# EAGLE design OreSat0_plusZendcard (EAGLE 9.6.2)

## Sheet 1 of 3: CONNECTORS
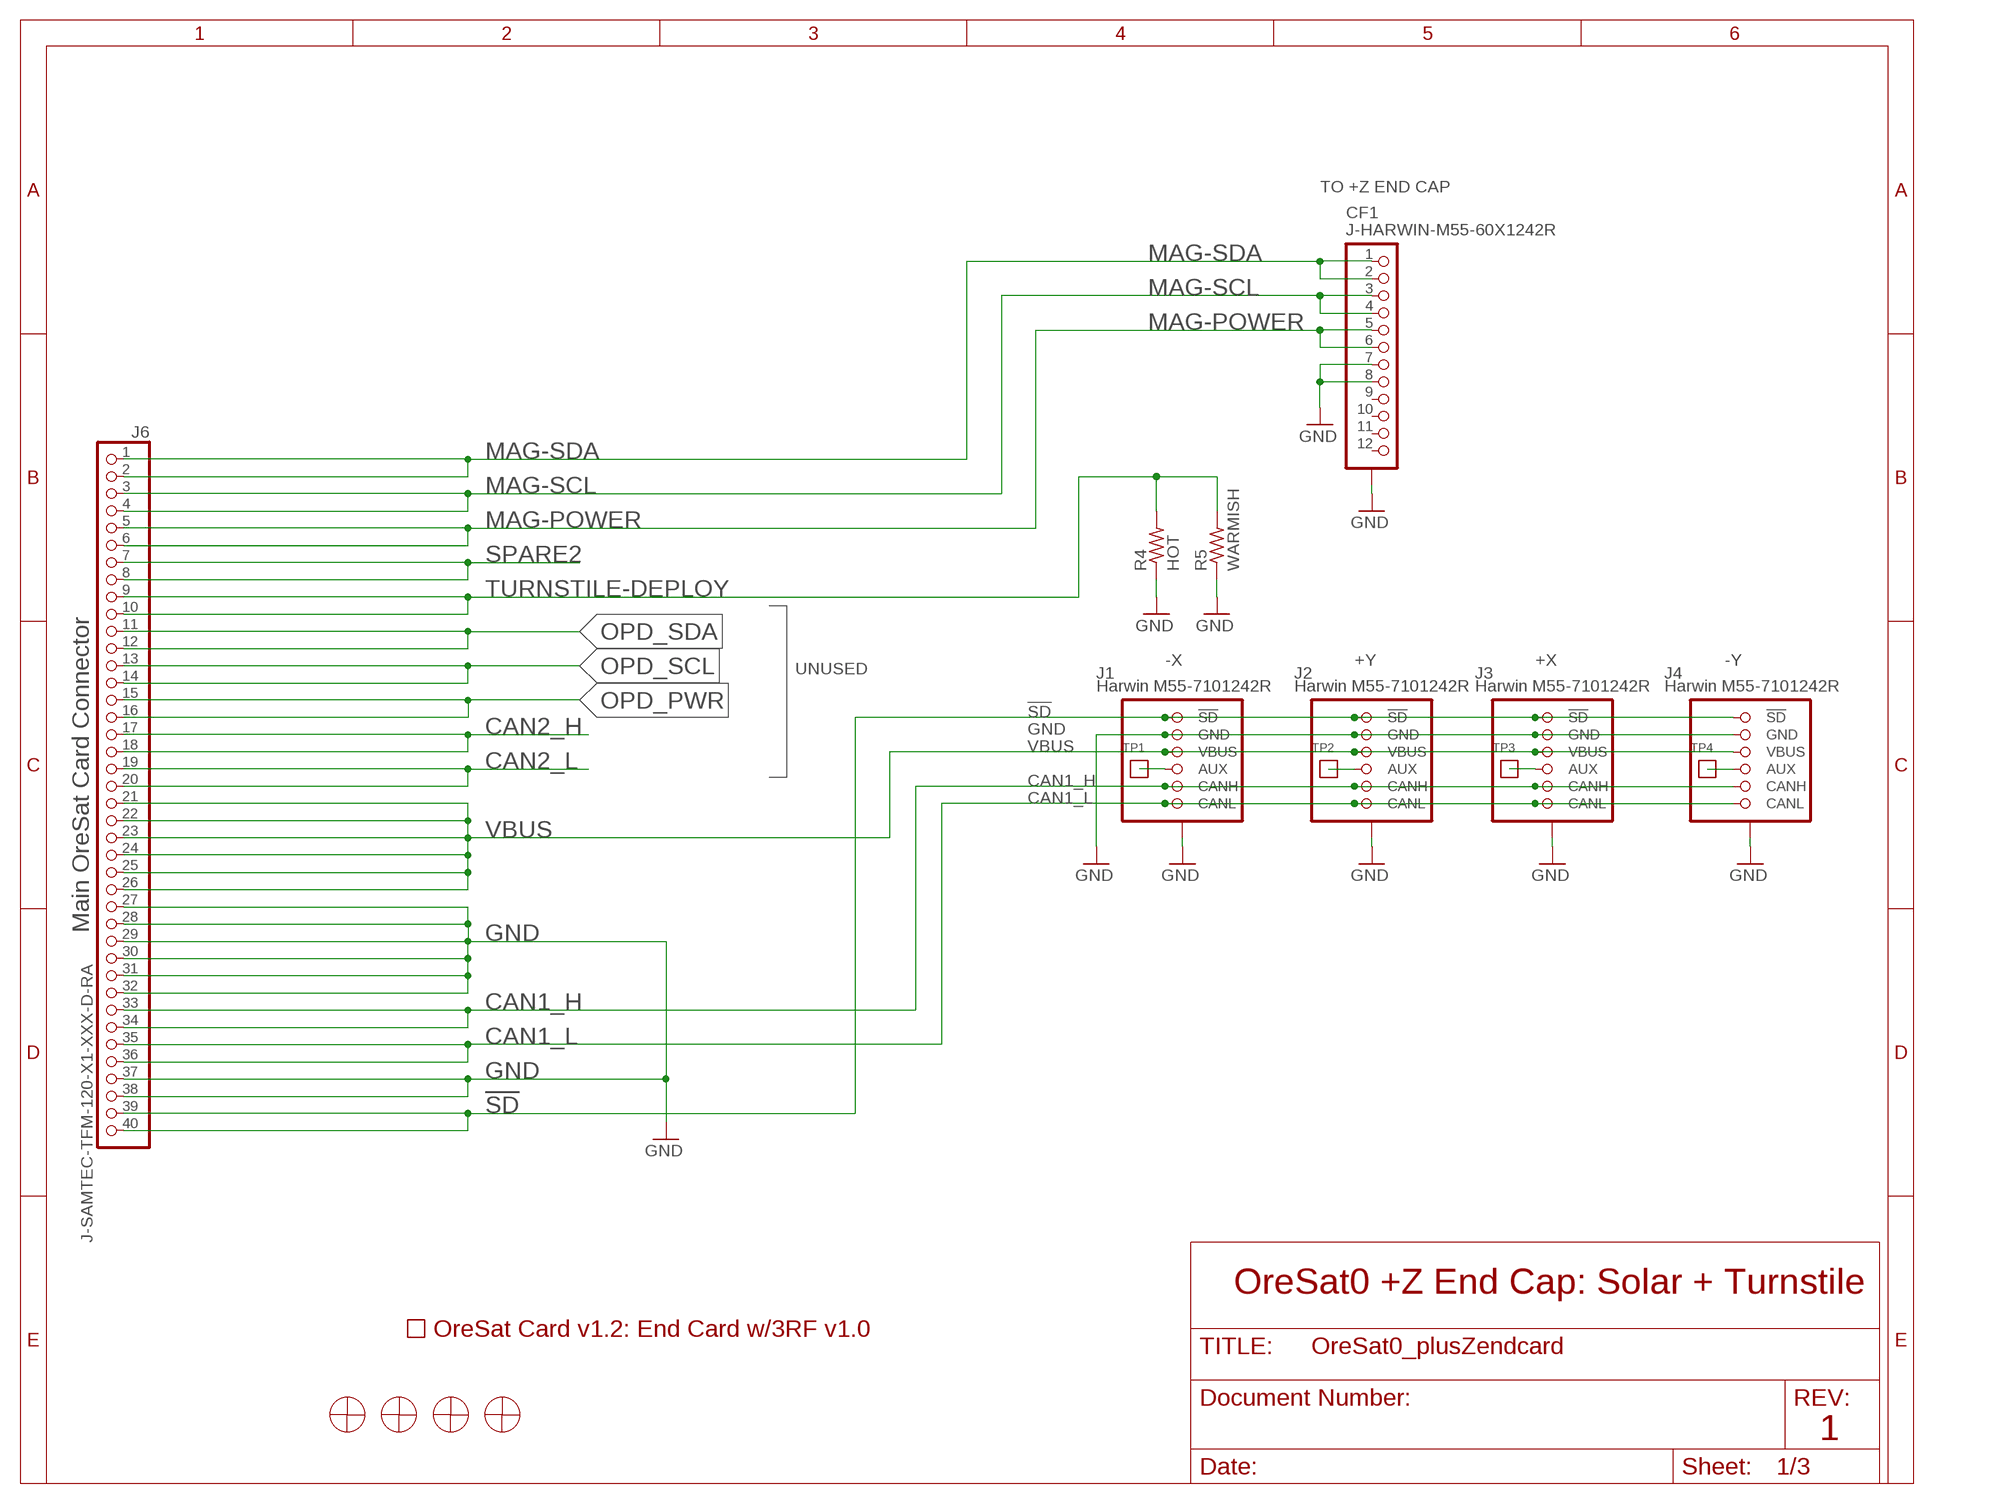
[diagram p0: schematic, sheet 1]

### Parts
CF1  J-HARWIN-M55-60X1242R  [HARWIN-M55-60X1242R]
J1  Harwin M55-7101242R  SOLAR-CARD-CONNECTOR  [M55-7101242R]
J2  Harwin M55-7101242R  SOLAR-CARD-CONNECTOR  [M55-7101242R]
J3  Harwin M55-7101242R  SOLAR-CARD-CONNECTOR  [M55-7101242R]
J4  Harwin M55-7101242R  SOLAR-CARD-CONNECTOR  [M55-7101242R]
J6  J-SAMTEC-TFM-120-X1-XXX-D-RA  [J-SAMTEC-TFM-120-X1-XXX-D-RA]
PCB1  ORESAT-CARD-V1.3-END-CARD-3RF-V1.0  [ORESAT-CARD-V1.3-END-CARD-3RF-V1.0]
R4  HOT  R-US_0309/12  [0309/12]
R5  WARMISH  R-US_0309/12  [0309/12]
TP1  TEST-POINT-LARGE-SQUARE  [1X01]
TP2  TEST-POINT-LARGE-SQUARE  [1X01]
TP3  TEST-POINT-LARGE-SQUARE  [1X01]
TP4  TEST-POINT-LARGE-SQUARE  [1X01]
U$9  MCMASTER-94100A150  [MCMASTER-94100A150]
U$10  MCMASTER-94100A150  [MCMASTER-94100A150]
U$11  MCMASTER-94100A150  [MCMASTER-94100A150]
U$12  MCMASTER-94100A150  [MCMASTER-94100A150]

### Nets
!SD [SHUTDOWN]: J1.1(!SD) J1.2(!SD) J2.1(!SD) J2.2(!SD) J3.1(!SD) J3.2(!SD) J4.1(!SD) J4.2(!SD) J6.39 J6.40
CAN1_H: J1.9(CANH) J1.10(CANH) J2.9(CANH) J2.10(CANH) J3.9(CANH) J3.10(CANH) J4.9(CANH) J4.10(CANH) J6.33 J6.34
CAN1_L: J1.11(CANL) J1.12(CANL) J2.11(CANL) J2.12(CANL) J3.11(CANL) J3.12(CANL) J4.11(CANL) J4.12(CANL) J6.35 J6.36
CAN2_H: J6.17 J6.18
CAN2_L: J6.19 J6.20
GND: CF1.7 CF1.8 CF1.P$1(SHIELDS) CF1.P$2(SHIELDS) CF1.P$3(SHIELDS) CF1.P$4(SHIELDS) J1.3(GND) J1.4(GND) J1.P$1(SHIELD) J1.P$2(SHIELD) J1.P$3(SHIELD) J1.P$4(SHIELD) J2.3(GND) J2.4(GND) J2.P$1(SHIELD) J2.P$2(SHIELD) J2.P$3(SHIELD) J2.P$4(SHIELD) J3.3(GND) J3.4(GND) J3.P$1(SHIELD) J3.P$2(SHIELD) J3.P$3(SHIELD) J3.P$4(SHIELD) J4.3(GND) J4.4(GND) J4.P$1(SHIELD) J4.P$2(SHIELD) J4.P$3(SHIELD) J4.P$4(SHIELD) J6.27 J6.28 J6.29 J6.30 J6.31 J6.32 J6.37 J6.38 R4.1 R5.1 ; also sheet 2,3
MAG-POWER: CF1.5 CF1.6 J6.5 J6.6
MAG-SCL: CF1.3 CF1.4 J6.3 J6.4
MAG-SDA: CF1.1 CF1.2 J6.1 J6.2
N$7: J1.7(AUX) J1.8(AUX) TP1.1
N$8: J2.7(AUX) J2.8(AUX) TP2.1
N$9: J3.7(AUX) J3.8(AUX) TP3.1
N$10: J4.7(AUX) J4.8(AUX) TP4.1
OPD_PWR: J6.15 J6.16
OPD_SCL: J6.13 J6.14
OPD_SDA: J6.11 J6.12
SPARE2: J6.7 J6.8
TURNSTILE-DEPLOY: J6.9 J6.10 R4.2 R5.2
VBUS: J1.5(VBUS) J1.6(VBUS) J2.5(VBUS) J2.6(VBUS) J3.5(VBUS) J3.6(VBUS) J4.5(VBUS) J4.6(VBUS) J6.21 J6.22 J6.23 J6.24 J6.25 J6.26
Unconnected: CF1.9 CF1.10 CF1.11 CF1.12

### Notes on the sheet
- TO +Z END CAP
- -X | +Y | +X | -Y
- UNUSED
- Main OreSat Card Connector
- OreSat0 +Z End Cap: Solar + Turnstile
- 1

## Sheet 2 of 3: UHF
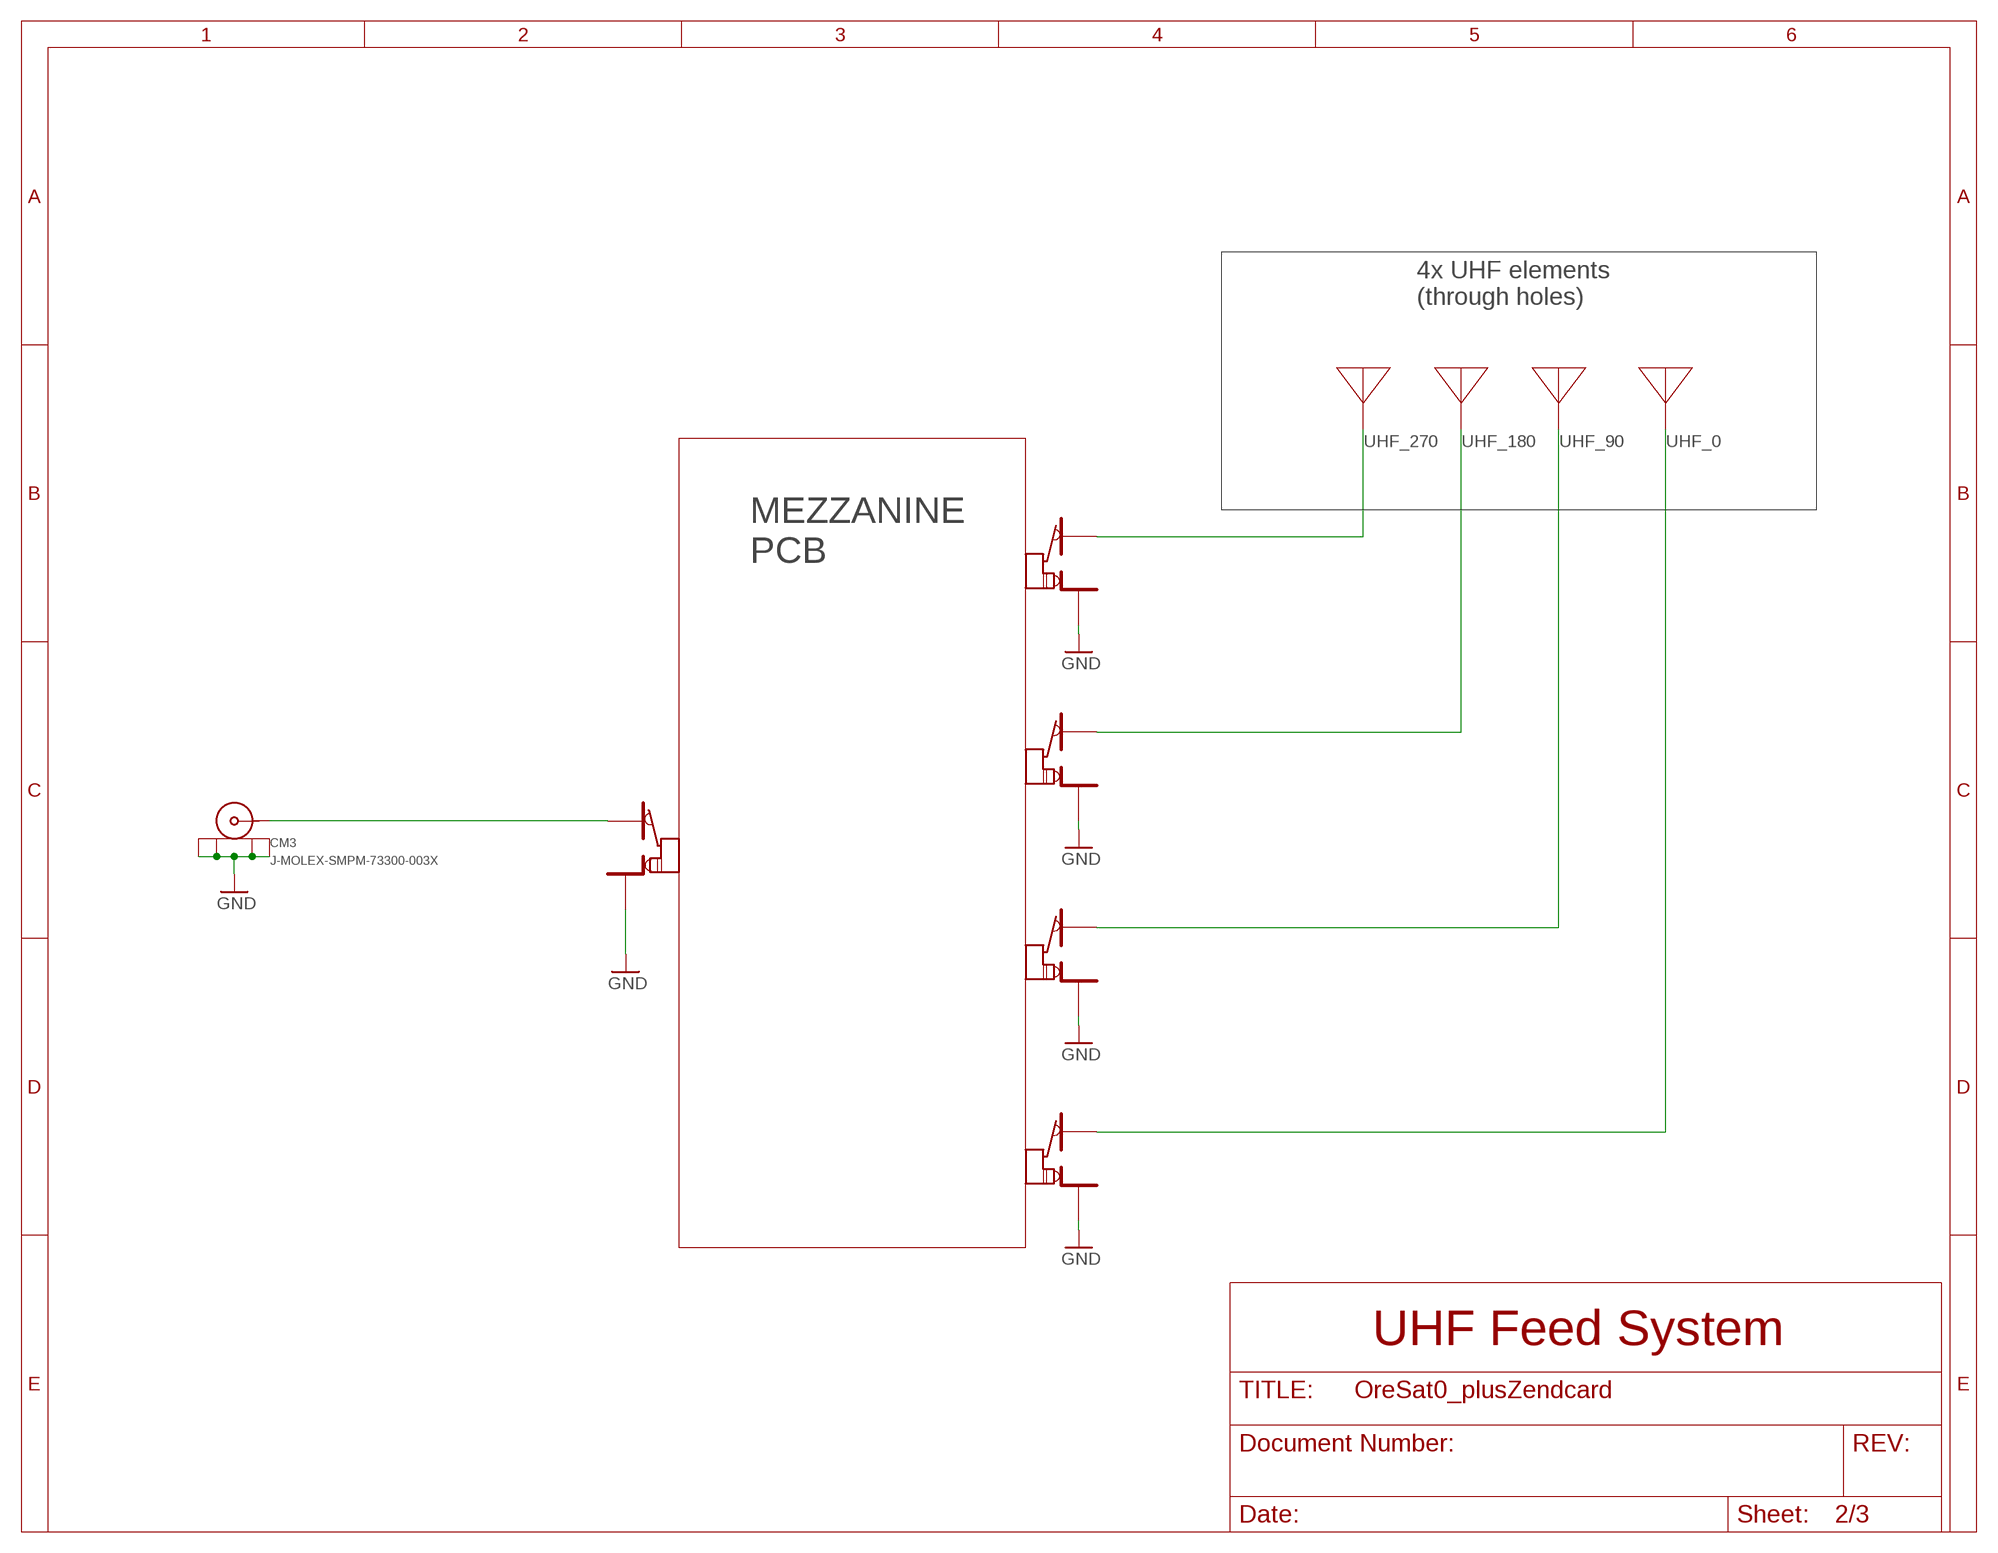
[diagram p1: schematic, sheet 2]

### Parts
CM3  J-MOLEX-SMPM-73300-003X  [J-MOLEX-SMPM-73300-003X]
U$4  R107064070_CONTACT  [R107064070_CONTACT]
U$5  R107064070_CONTACT  [R107064070_CONTACT]
U$6  R107064070_CONTACT  [R107064070_CONTACT]
U$7  R107064070_CONTACT  [R107064070_CONTACT]
U$8  R107064070_CONTACT  [R107064070_CONTACT]

### Nets
GND: CM3.P$1(SHIELD3) CM3.P$2(SHIELD2) CM3.P$3(SHIELD1) CM3.P$4(SHIELD) U$4.P$2 U$4.P$3 U$5.P$2 U$5.P$3 U$6.P$2 U$6.P$3 U$7.P$2 U$7.P$3 U$8.P$2 U$8.P$3 ; also sheet 1,3
N$12 [RF]: CM3.RF(CENTER) U$4.P$1
UHF_0 [RF]: U$8.P$1
UHF_90 [RF]: U$7.P$1
UHF_180 [RF]: U$6.P$1
UHF_270 [RF]: U$5.P$1

### Notes on the sheet
- 4x UHF elements
  (through holes)
- MEZZANINE
  PCB
- UHF Feed System

## Sheet 3 of 3: L BAND
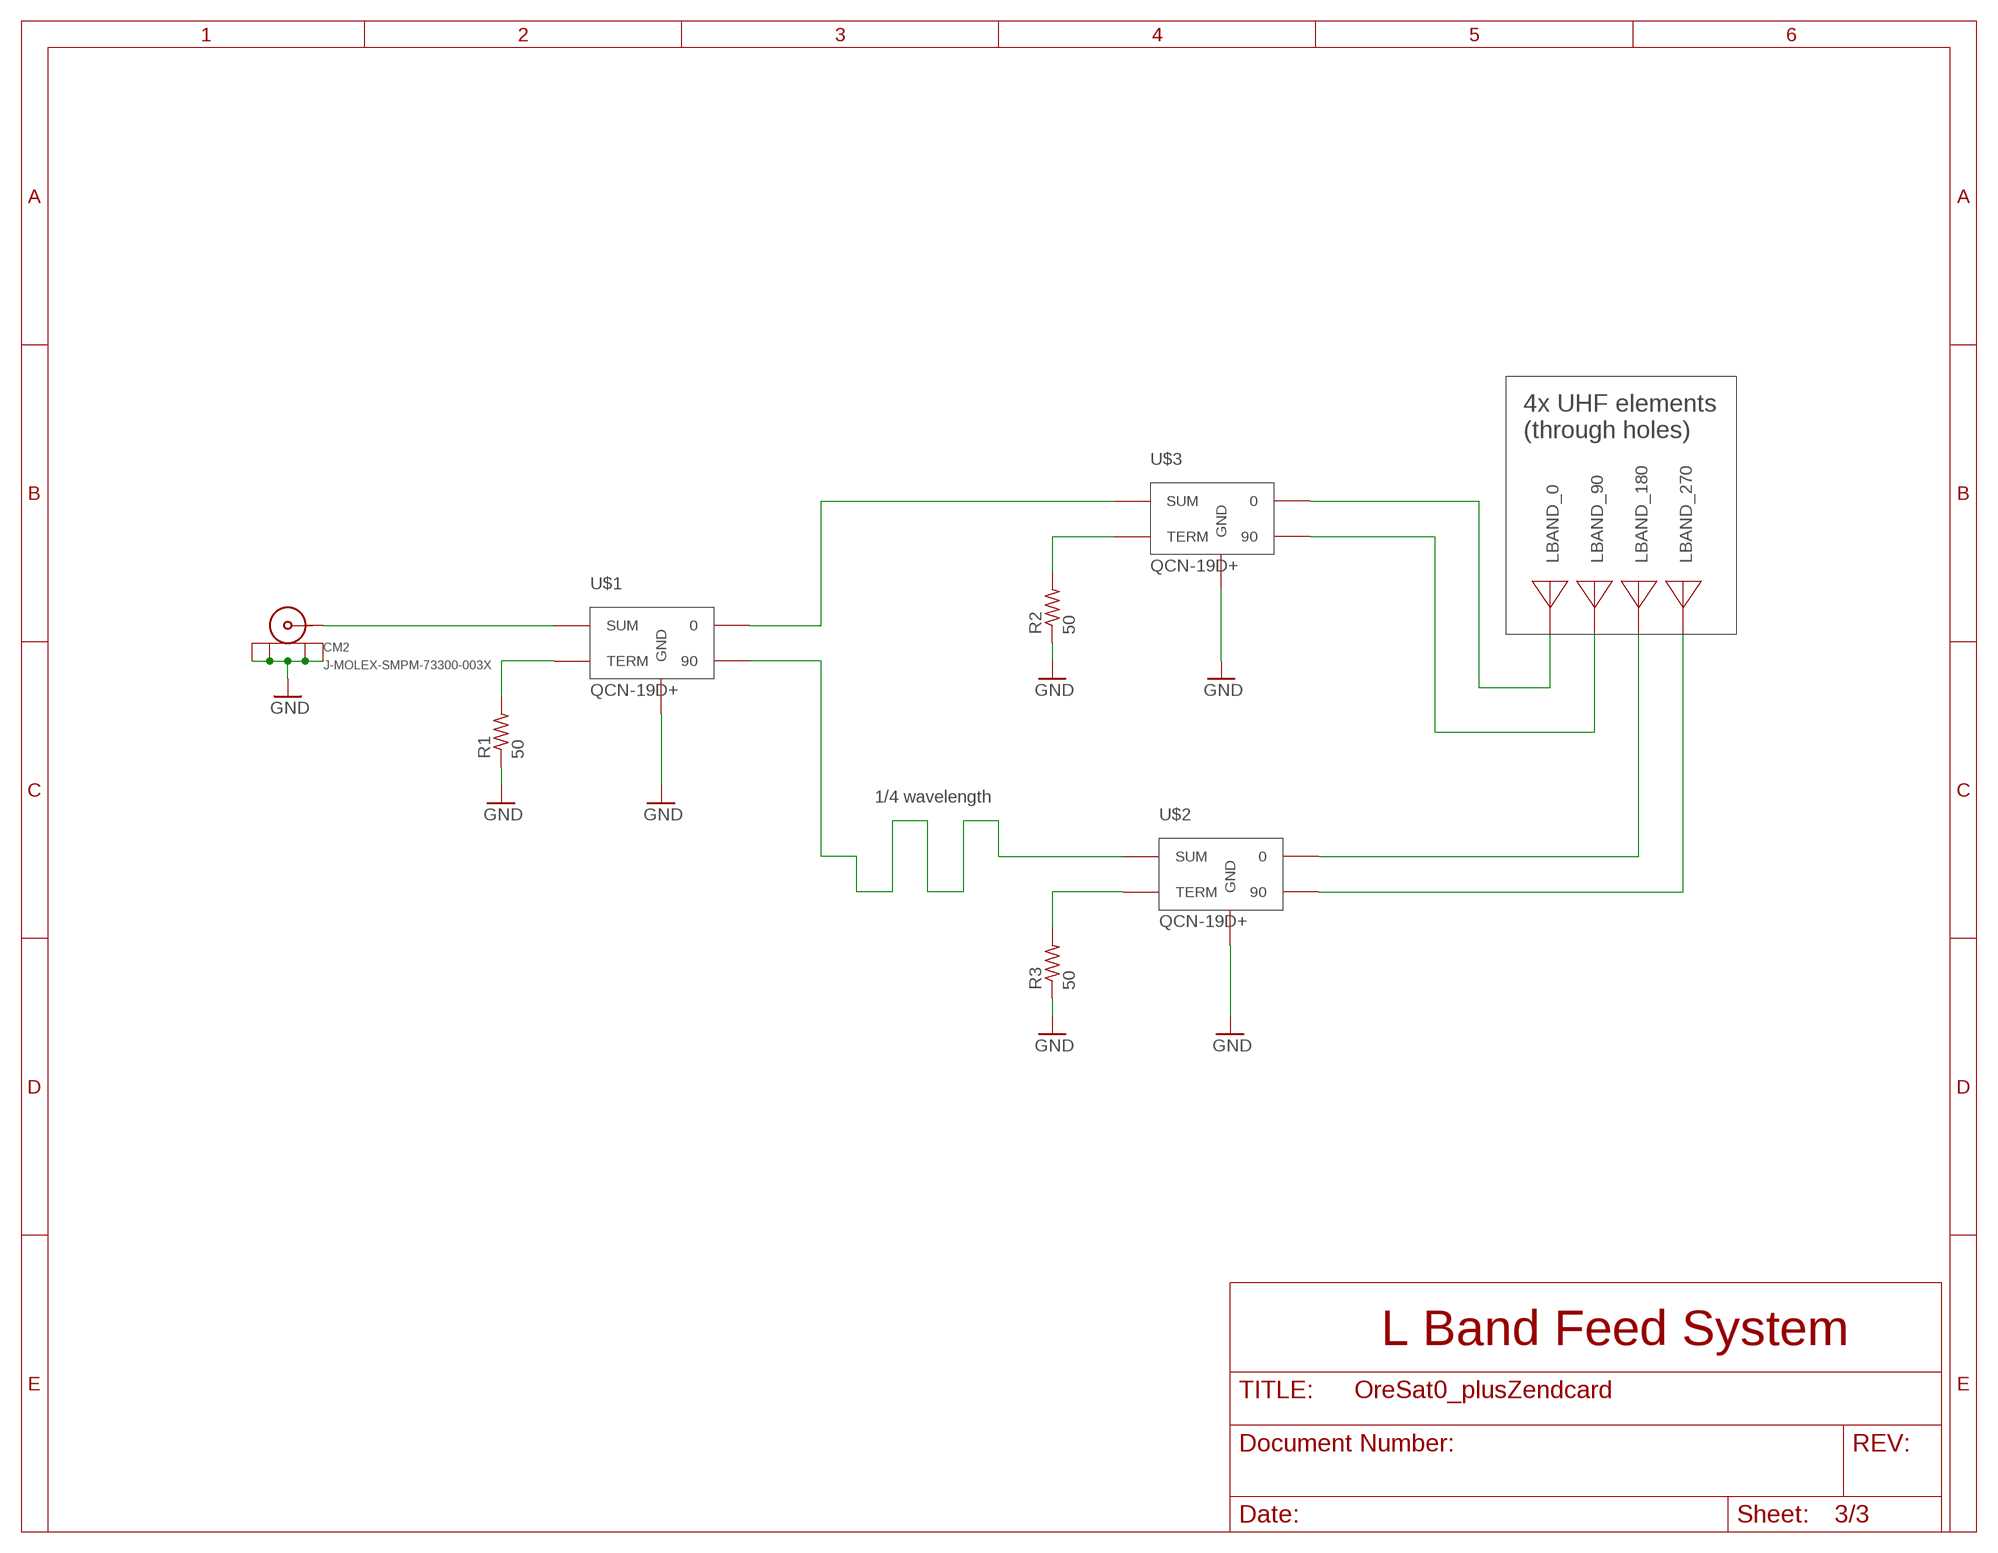
[diagram p2: schematic, sheet 3]

### Parts
CM2  J-MOLEX-SMPM-73300-003X  [J-MOLEX-SMPM-73300-003X]
R1  50  R-US_0805-B-NOSILK  [.0805-B-NOSILK]
R2  50  R-US_0805-B-NOSILK  [.0805-B-NOSILK]
R3  50  R-US_0805-B-NOSILK  [.0805-B-NOSILK]
U$1  QCN-19D+  [QVN-19D+]
U$2  QCN-19D+  [QVN-19D+]
U$3  QCN-19D+  [QVN-19D+]

### Nets
GND: CM2.P$1(SHIELD3) CM2.P$2(SHIELD2) CM2.P$3(SHIELD1) CM2.P$4(SHIELD) R1.1 R2.1 R3.1 U$1.P$2(GND) U$1.P$5(GND) U$2.P$2(GND) U$2.P$5(GND) U$3.P$2(GND) U$3.P$5(GND) ; also sheet 1,2
LBAND_0 [RF]: U$3.P$4
LBAND_90 [RF]: U$3.P$6
LBAND_180 [RF]: U$2.P$4
LBAND_270 [RF]: U$2.P$6
N$1 [RF]: CM2.RF(CENTER) U$1.P$1(SUM)
N$2 [RF]: U$1.P$4 U$3.P$1(SUM)
N$3: R1.2 U$1.P$3(TERM)
N$4: R2.2 U$3.P$3(TERM)
N$5 [RF]: U$1.P$6 U$2.P$1(SUM)
N$6: R3.2 U$2.P$3(TERM)

### Notes on the sheet
- 4x UHF elements
  (through holes)
- 1/4 wavelength
- L Band Feed System

## Library data of the parts
CF1 = J-Harwin-M55-60X1242R-12pin-1.27mm-F-vertical:J-HARWIN-M55-60X1242R; DESCRIPTION: connector; DIST: Digi-Key; DIST_PN: 952-3851-1-ND; GENERIC: N; MFG: Harwin; MFG_PN: M55-6021242R; P-NP: P
CM2 CM3 = J-Molex-SMPM-73300-003X:J-MOLEX-SMPM-73300-003X: Edge mounted 50 ohm SMPM RF connection Molex 0733000020 Datasheet <https://www.molex.com/pdm_docs/ps/PS-89675-3730.pdf>; DESCRIPTION: Edge mounted SMPM 50 ohm RF connector; DIST: Digi-Key; DIST_PN: WM10772-ND; GENERIC: N; MFG: MOLEX; MFG_PN: 0733000020; P-NP: P
J1-J4 = J-Harwin-M55-7101242-Solar-card-connector:SOLAR-CARD-CONNECTOR: OreSat End Card Solar Connector This 12pin 1.27 mm male SMT connector (Harwin M55-7101242R) is used on the end cards to attach to the solar boards. Note: alignment pin hole diameters are 0.05 mm smaller than recommended in order to tighten up connector location; this requires hand placement of this package.; DESCRIPTION: SMT 12 pos Conn Header 1.27mm pitch; DIST: Digi-Key; DIST_PN: 952-3891-ND; GENERIC: N; MFG: Harwin Inc.; MFG_PN: M55-7101242R; P-NP: P
J6 = J-Samtec-TFM-120-X1-XXX-D-RA:J-SAMTEC-TFM-120-X1-XXX-D-RA; DIS: Digi-Key; DPN: SAM10145-ND; MFR: Samtec; MPN: TFM-120-01-L-D-RA
PCB1 = oresat-cards:ORESAT-CARD-V1.3-END-CARD-3RF-V1.0
R1-R5 = oresat-rcl:R-US_: RESISTOR, American symbol
TP1-TP4 = oresat-misc:TEST-POINT-LARGE-SQUARE
U$1-U$3 = Mini-Circuits-QCN-19D+_Phase-shifter:QCN-19D+
U$4-U$8 = J-Radiall-R107064070-RF:R107064070_CONTACT: Contact pad for surface to surface RF connector This is not a physical part, it's just a landing pad Datasheet for physical part: Datasheet <https://www.mouser.com/datasheet/2/516/radiall_radls10120-1-1746158.pdf>; DESCRIPTION: Landing pad for RF connector; P-NP: NP
U$9-U$12 = HW-mcmaster-94100A150-M2-threaded-insert:MCMASTER-94100A150

## Net classes
1 RF: clearance 1 mm
2 SHUTDOWN: clearance 0.3 mm

## Board
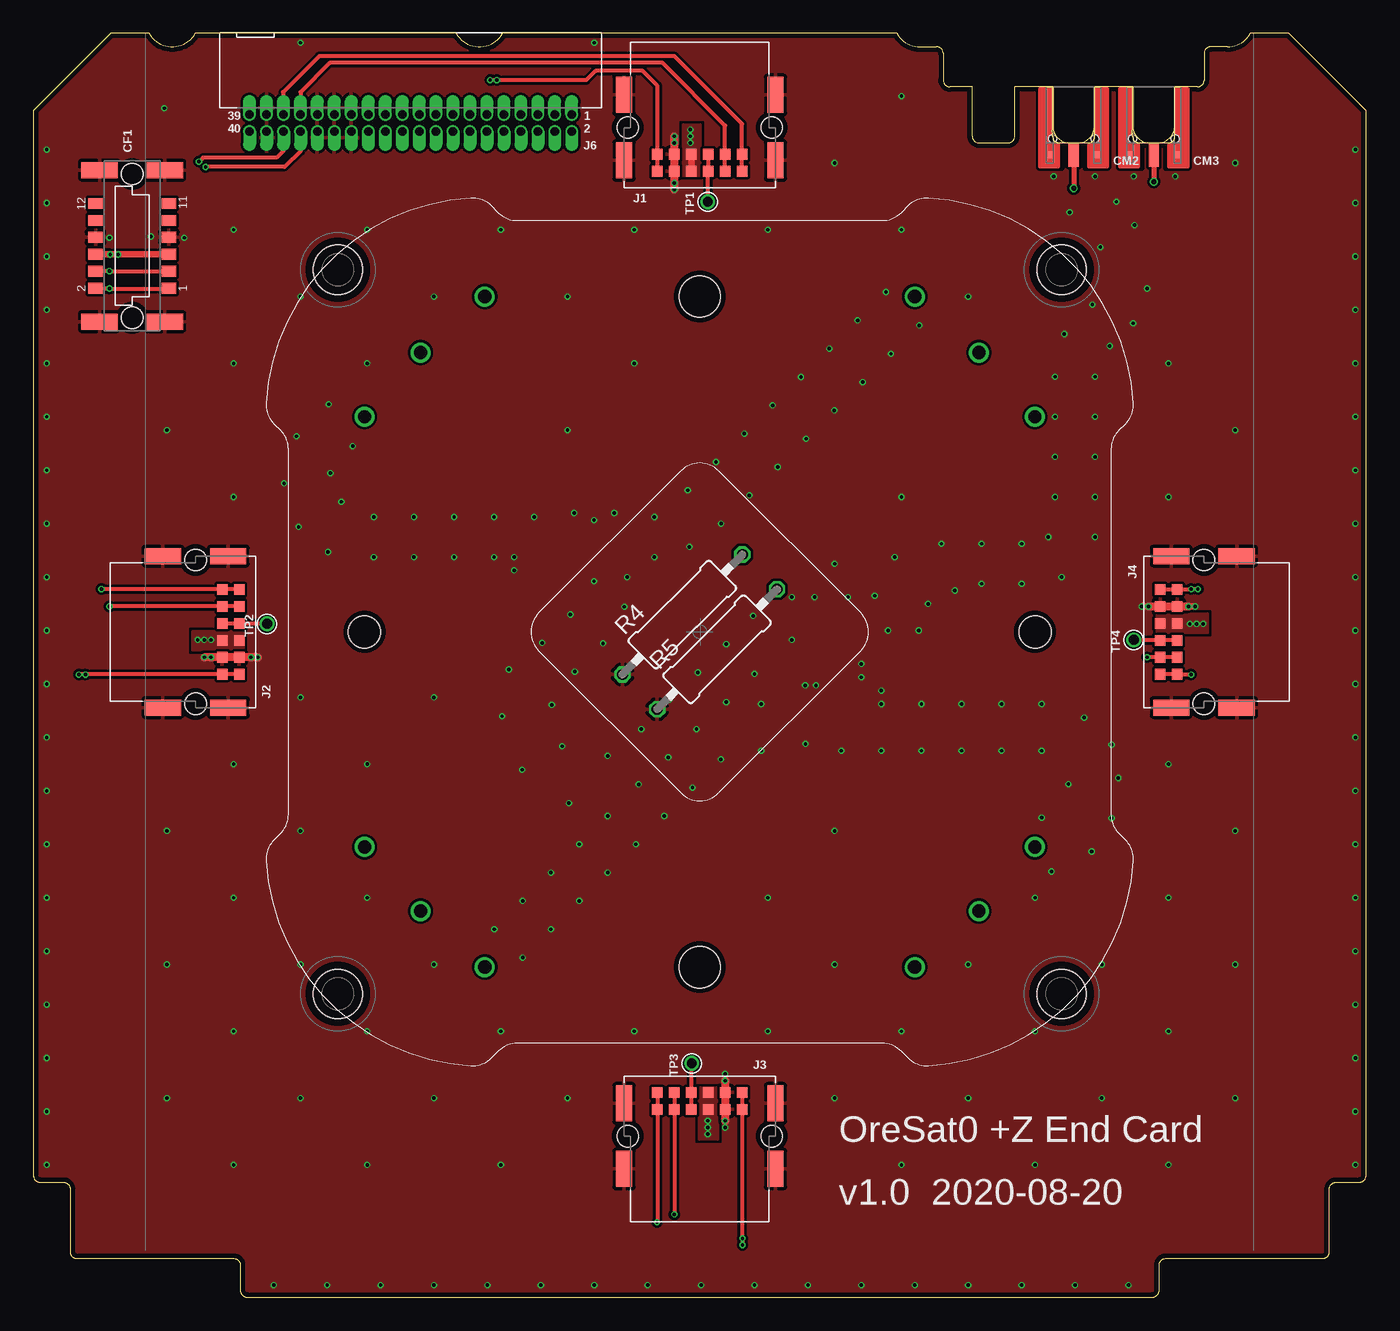
[diagram p3: board, top side]
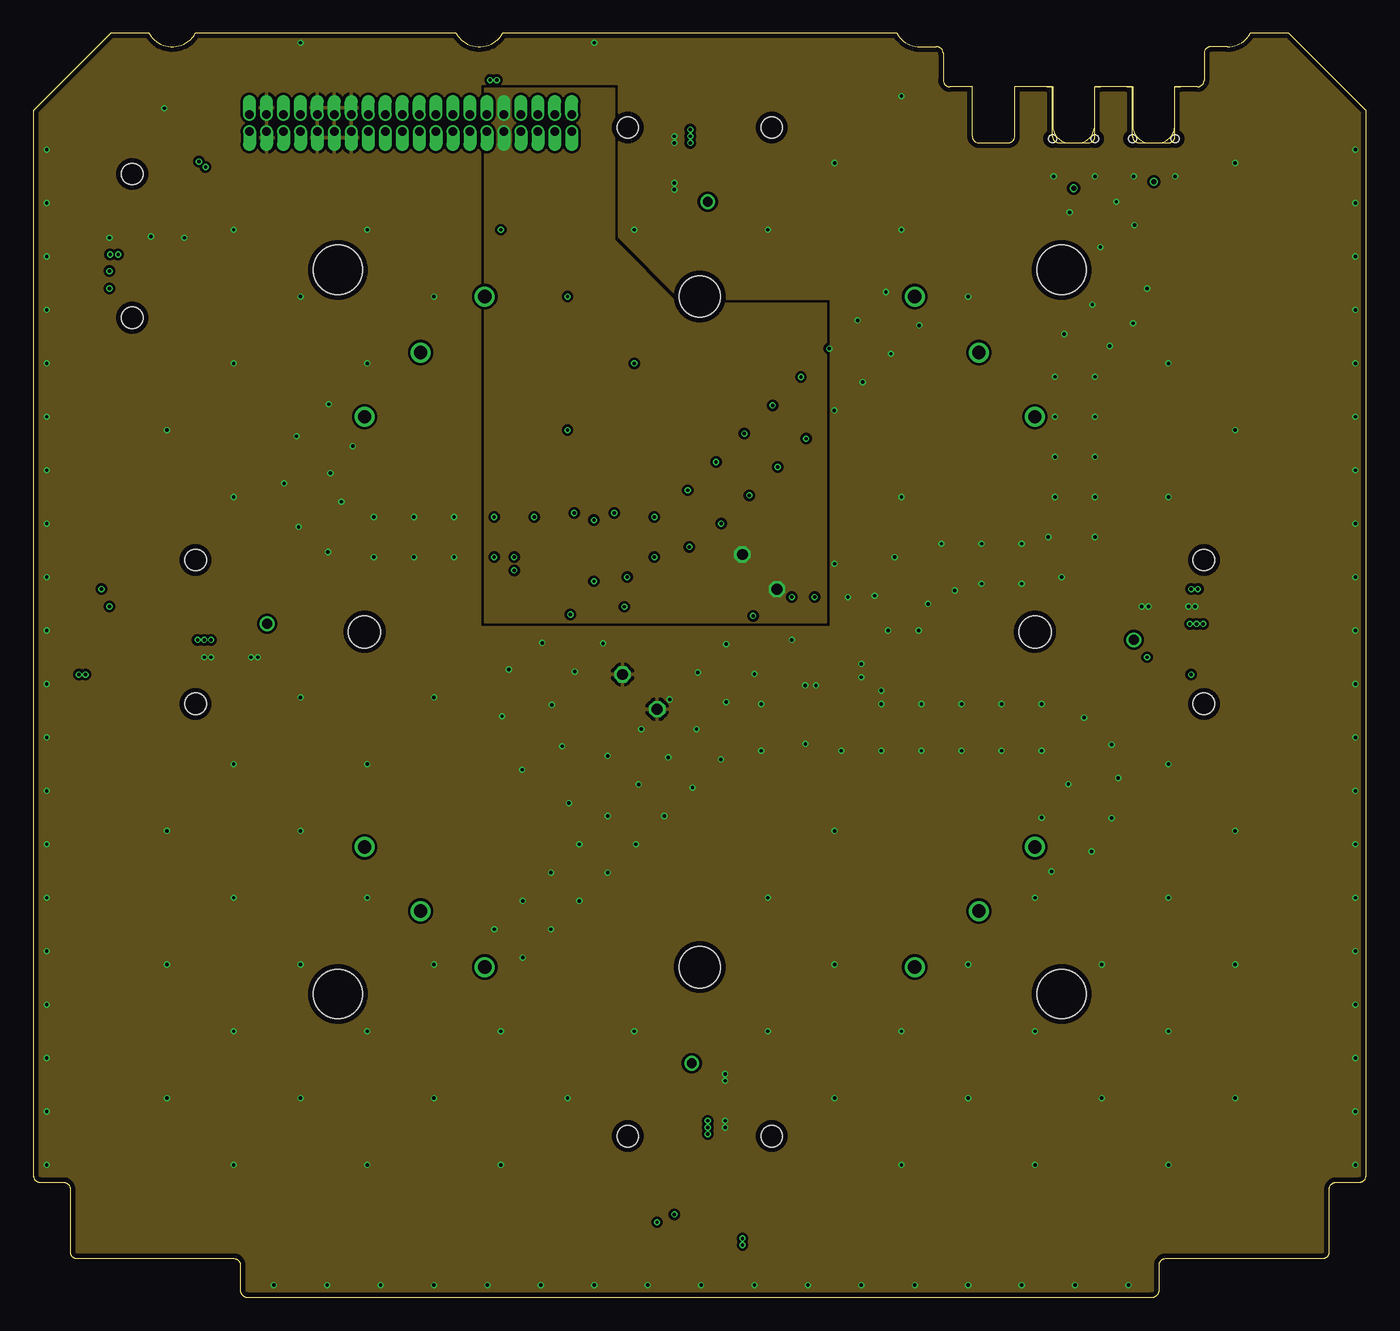
[diagram p4: board, inner layer Route2]
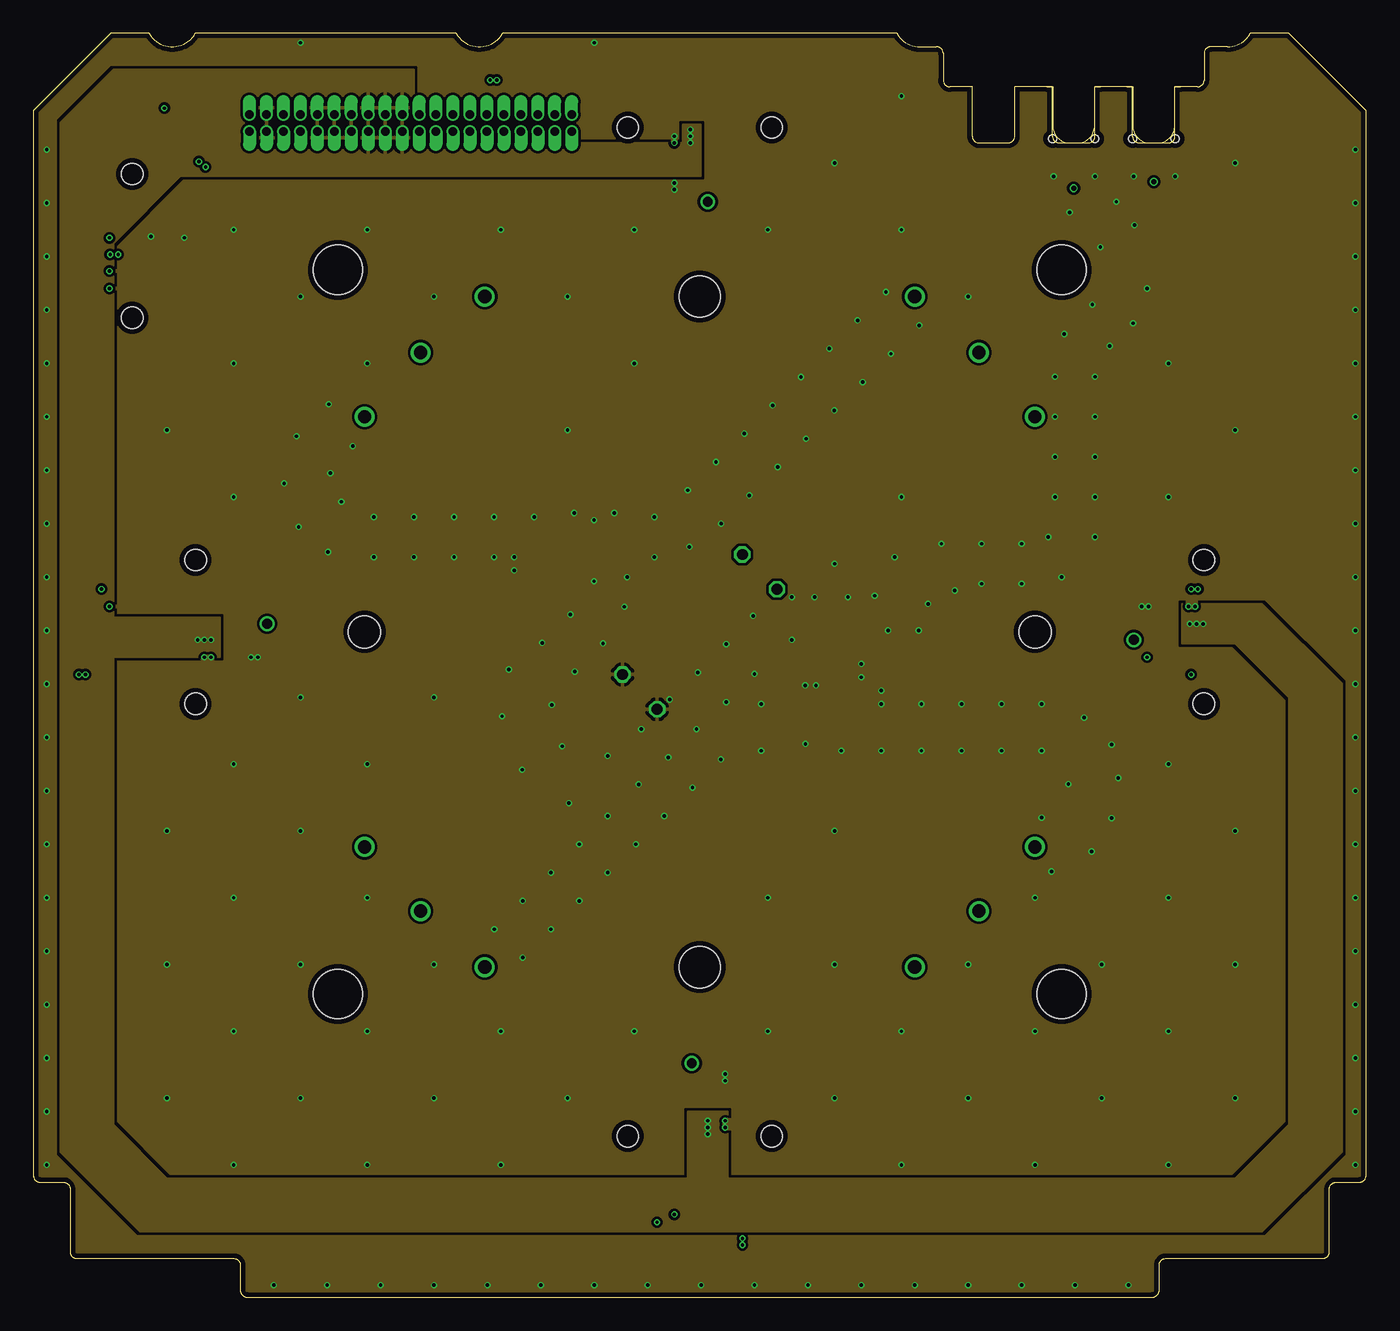
[diagram p5: board, inner layer Route15]
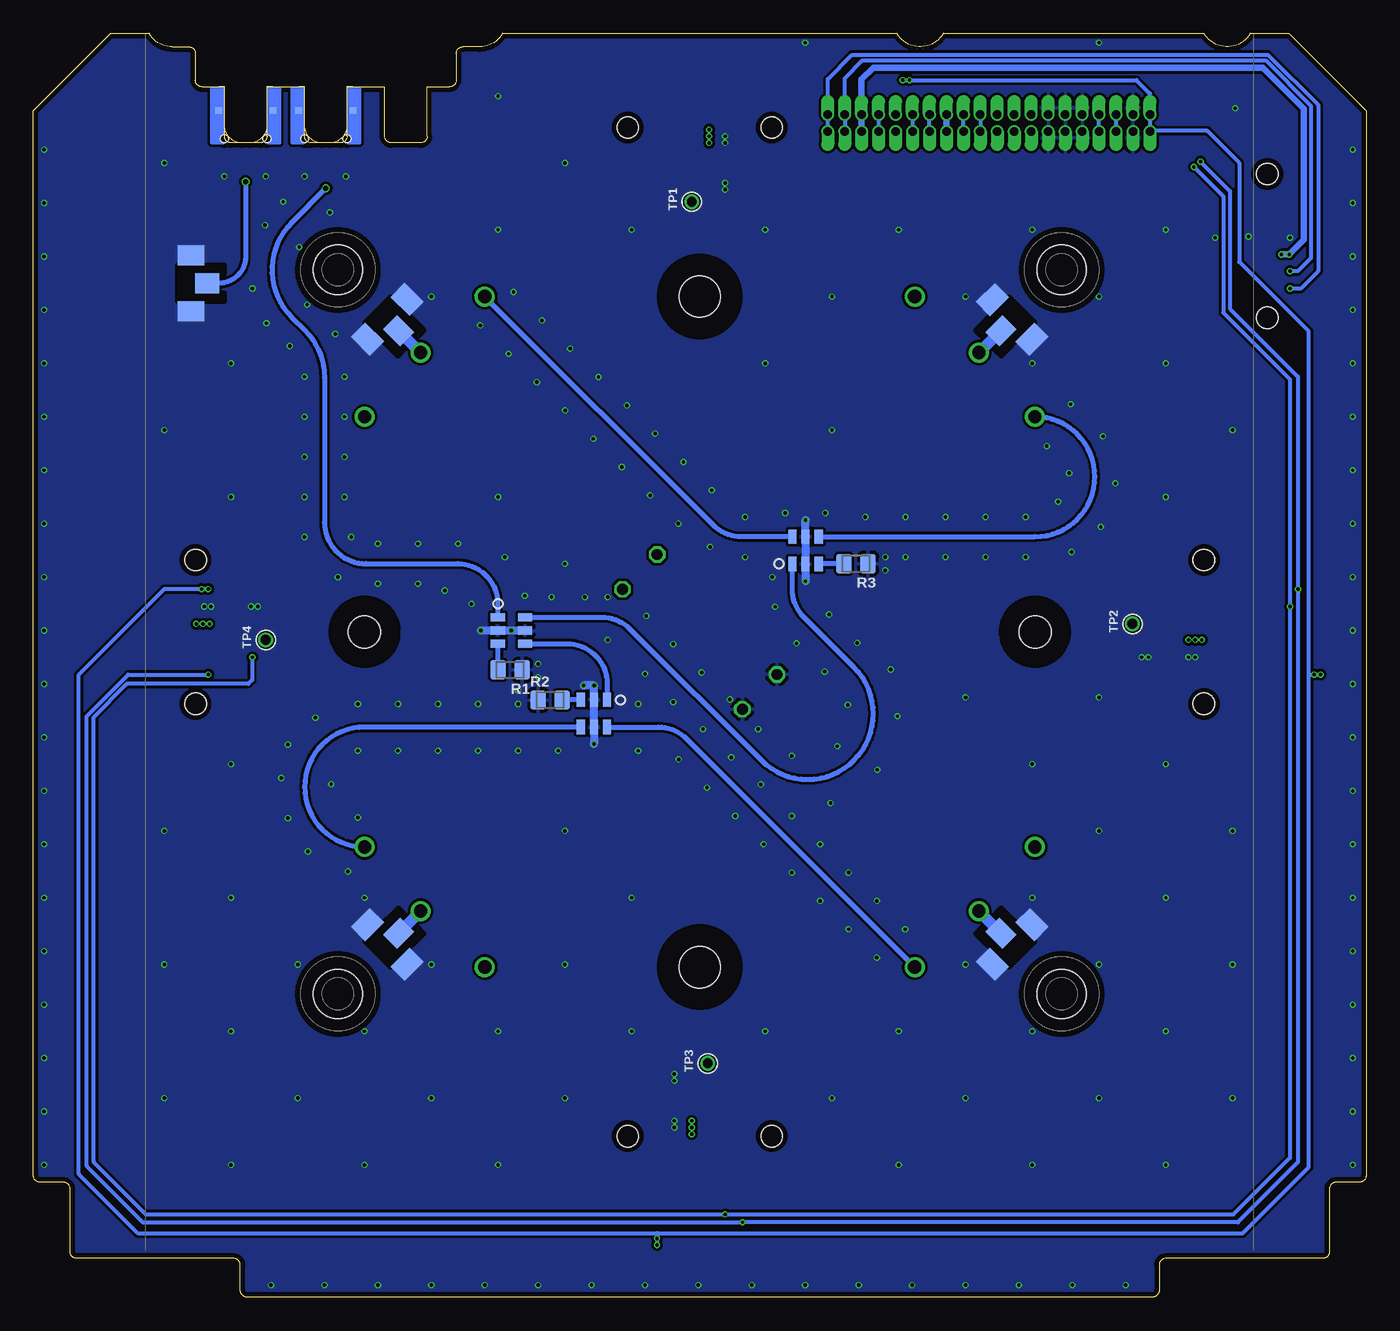
[diagram p6: board, bottom side, seen from below]

Size 99.8 x 94.6 mm. Coordinates in mm from the lower left corner, seen from the top.
Copper layers (1*2*15*16): Top 0.035559375mm / dielectric 0.17018125mm / Route2 0.01778125mm / dielectric 47mil / Route15 0.01778125mm / dielectric 0.17018125mm / Bottom 0.035559375mm
Design rules "oshpark-4layer *": minimum track width 5mil, minimum drill 10mil, track to track 5mil, track to pad 5mil, pad to pad 5mil, via to via 5mil, smd to smd 5mil, copper to edge 15mil, drill to drill 6mil, minimum pad ring 4mil, minimum via ring 4mil, stop-mask expansion 2.5mil, vias tented up to drill 10mil, thermal gap 10mil
Holes 3.1 mm at 49.9,74.9 49.9,24.7
Holes 2.4 mm at 24.8,49.8 75,49.8
bRestrict: area 46.9,71.9 to 52.9,77.9; area 46.9,21.7 to 52.9,27.7; area 22.3,47.3 to 27.3,52.3; area 72.5,47.3 to 77.5,52.3

### Footprints (pad centres in the part's own frame; a part is rotated, then mirrored left to right if it is on the bottom)
HARWIN-M55-60X1242R = smd 0.8 x 1.1: 1 -3.175,-2.75; 2 -3.175,2.75; 3 -1.905,-2.75; 4 -1.905,2.75; 5 -0.635,-2.75; 6 -0.635,2.75; 7 0.635,-2.75; 8 0.635,2.75; 9 1.905,-2.75; 10 1.905,2.75; 11 3.175,-2.75; 12 3.175,2.75 | smd 1.2 x 2.7: P$1 -5.67,-2.45; P$2 -5.67,2.45; P$3 5.67,2.45; P$4 5.67,-2.45 | hole 1.6: -5.385,0; 5.385,0
J-MOLEX-SMPM-73300-003X = smd 0.508 x 0.508: P$1 -1.778,-5.08; P$2 1.778,-5.08 | smd 0.508 x 0.508 bottom: P$3 -2.032,-1.778; P$4 2.032,-1.778 | smd 0.762 x 1.778: RF 0,-5.08 | hole 0.61: 1.587,-3.886; -1.587,-3.886
M55-7101242R = smd 0.8 x 0.8: 1 3.175,2; 2 3.175,3.27; 3 1.905,2; 4 1.905,3.27; 5 0.635,2; 6 0.635,3.27; 7 -0.635,2; 8 -0.635,3.27; 9 -1.905,2; 10 -1.905,3.27; 11 -3.175,2; 12 -3.175,3.27 | smd 1.2 x 2.7: P$1 5.67,2.45; P$2 5.67,-2.45; P$3 -5.67,2.45; P$4 -5.67,-2.45 | hole 1.6: 5.385,0; -5.385,0
J-SAMTEC-TFM-120-X1-XXX-D-RA = drill 0.635 pad 0.965 offset: 1 12.065,0.635; 2 12.065,-0.635; 3 10.795,0.635; 4 10.795,-0.635; 5 9.525,0.635; 6 9.525,-0.635; 7 8.255,0.635; 8 8.255,-0.635; 9 6.985,0.635; 10 6.985,-0.635; 11 5.715,0.635; 12 5.715,-0.635; 13 4.445,0.635; 14 4.445,-0.635; 15 3.175,0.635; 16 3.175,-0.635; 17 1.905,0.635; 18 1.905,-0.635; 19 0.635,0.635; 20 0.635,-0.635; 21 -0.635,0.635; 22 -0.635,-0.635; 23 -1.905,0.635; 24 -1.905,-0.635; 25 -3.175,0.635; 26 -3.175,-0.635; 27 -4.445,0.635; 28 -4.445,-0.635; 29 -5.715,0.635; 30 -5.715,-0.635; 31 -6.985,0.635; 32 -6.985,-0.635; 33 -8.255,0.635; 34 -8.255,-0.635; 35 -9.525,0.635; 36 -9.525,-0.635; 37 -10.795,0.635; 38 -10.795,-0.635; 39 -12.065,0.635; 40 -12.065,-0.635
.0805-B-NOSILK = smd 1.15 x 1.45: 1 -0.9,0; 2 0.9,0
0309/12 = drill 0.813 octagon: 1 -6.35,0; 2 6.35,0
1X01 = drill 0.737 pad 1.1: 1 0,0
QVN-19D+ = smd 0.61 x 1.07: P$1 -0.99,-1.025; P$2 0,-1.025; P$3 0.99,-1.025; P$4 0.99,1.025; P$5 0,1.025; P$6 -0.99,1.025
R107064070_CONTACT = smd 1.5 x 1.8: P$1 0,-1.2 | smd 1.5 x 2: P$2 -2.1,0; P$3 2.1,0
MCMASTER-94100A150 = hole 3.7: 0,0

### Placement (x,y rotation side)
CF1  7.4,78.7 90 top
CM2  77.9,90.6 0 top
CM3  83.9,90.6 0 top
J1  49.9,87.55 180 top
J2  12.15,49.8 270 top
J3  49.9,12.05 0 top
J4  87.65,49.8 90 top
J6  28.25,87.9 0 top
PCB1  0,-0.1 0 top
R1  64.1,46.95 180 bottom
R2  61.1,44.7 0 bottom
R3  38.2,54.9 180 bottom
R4  48.6,51.1 45 top
R5  51.2,48.5 45 top
TP1  50.5,82 90 top
TP2  17.5,50.4 90 top
TP3  49.3,17.5 90 top
TP4  82.4,49.2 90 top
U$1  64,49.9 270 bottom
U$2  41.98,55.9 0 bottom
U$3  57.82,43.7 180 bottom
U$4  88,75.9 90 bottom
U$5  73.3,26.4 135 bottom
U$6  26.5,26.4 225 bottom
U$7  26.51,73.19 315 bottom
U$8  73.3,73.2 45 bottom
U$9  77,76.9 0 top
U$10  77,22.7 0 top
U$11  22.8,76.9 0 top
U$12  22.8,22.7 0 top

### Tracks (layer width: path | path; a pad name or v marks a point on that pad's centre or on a via)
!SD  (via drill 0.25)
  Top 0.3: J1.2 J1.1 46.73,90.68 45.6,91.8 42.1,91.8 41.4,91.1 v34.2,91.1 | J2.2 J2.1 3.42,46.62 v3.4,46.6 | J3.2 J3.1 53.08,4.43 v53.1,4.4 v53.1,3.9 | J4.2 J4.1 86.7,52.98 v86.7,53 v87.2,53
  Bottom 0.3: 53.1,4.8 92,4.8 96.4,9.2 96.4,46.6 90,53 v86.7,53 | 53.1,4.8 9.23,4.8 4.3,9.73 4.3,46.6 | 53.1,4.8 v53.1,4.4 v53.1,3.9 | 4.3,46.6 4.3,72.3 9.5,77.5 9.5,84.9 11.9,87.3 16.15,87.3 J6.40 J6.39 16.18,90.09 17.2,91.1 v34.2,91.1 v34.7,91.1 | 4.3,46.6 v3.9,46.6 v3.4,46.6
CAN1_H  (via drill 0.25)
  Top 0.3: J1.10 J1.9 51.8,87.7 47.1,92.4 22.2,92.4 20,90.2 J6.33 | J2.10 J2.9 v5.71,51.7 v5.7,51.7 | J3.10 J3.9 v47.99,6.2 v48,6.2 | J4.9 J4.10 v83.4,47.89 v83.4,47.9 | J6.34 20,85.8 18.8,84.6 v12.9,84.6
  Bottom 0.3: J6.34 J6.33 | v83.4,47.9 83.4,46.2 83.7,45.9 92.8,45.9 95.27,43.42 95.27,10.1 91.37,6.2 v48,6.2 9.93,6.2 5.7,10.43 v5.7,51.7 5.7,68.7 10.7,73.7 10.7,82.4 v12.9,84.6
CAN1_L  (via drill 0.25)
  Top 0.3: J1.12 J1.11 53.08,87.83 48,92.9 21.4,92.9 18.7,90.2 18.7,88.56 J6.35 | J2.12 J2.11 5.12,52.98 v5.1,53 | J3.12 J3.11 46.73,5.61 v46.7,5.61 | v86.7,46.6 85.65,46.6 J4.11 J4.12 | J6.36 18.73,85.83 18.2,85.3 12.7,85.3 v12.4,85
  Bottom 0.3: J6.35 J6.36 | v86.7,46.6 92.7,46.6 95.8,43.5 95.8,9.8 91.6,5.6 v46.7,5.6 | v46.7,5.6 9.6,5.6 5.1,10.1 v5.1,53 5.1,68.9 10.2,74 10.2,82.8 v12.4,85 | v46.7,5.61 v46.7,5.6
CAN2_H
  Bottom 0.3: J6.18 J6.17
CAN2_L
  Bottom 0.3: J6.19 J6.20
GND  (via drill 0.25)
  Top 0.5: 83.19,51.7 83.1,51.8 | 86.8,51.7
  Top 0.6: v83.5,51.7 J4.4 J4.3 v86.5,51.7 | v51.8,16.2 J3.4 J3.3 v51.8,13.21 v51.8,13.2 | v16.8,47.9 v16.3,47.9 v16.3,47.89 J2.4 J2.3 v13.3,47.89 v13.3,47.9 v12.8,47.9 | v48,82.9 v48,83.4 J1.4 J1.3 v47.99,86.4 v48,86.4 v48,86.9
  Bottom 0.6: v58.6,45.8 v57.8,45.8 arc-45 57.82,45.75 U$3.P$2 U$3.P$5 v57.82,41.42 | v41.98,53.59 U$2.P$2 U$2.P$5 v41.98,58.17 | v66.29,49.9 U$1.P$2 v64,49.9 U$1.P$5
  other vias: 1,9.9 1,13.9 1,17.9 1,21.9 1,25.9 1,29.9 1,33.9 1,37.9 1,41.9 1,45.9 1,49.9 1,53.9 1,57.9 1,61.9 1,65.9 1,69.9 1,73.9 1,77.9 1,81.9 1,85.9 99,9.9 99,13.9 99,17.9 99,21.9 99,25.9 99,29.9 99,33.9 99,37.9 99,41.9 99,45.9 99,49.9 99,53.9 99,57.9 99,61.9 99,65.9 99,69.9 99,73.9 99,77.9 99,81.9 99,85.9 18,0.9 22,0.9 26,0.9 30,0.9 34,0.9 38,0.9 42,0.9 46,0.9 50,0.9 54,0.9 58,0.9 62,0.9 66,0.9 70,0.9 74,0.9 78,0.9 82,0.9 9.8,89 20,93.9 42,93.9 25.5,58.4 25.5,55.4 28.5,55.4 28.5,58.4 61,52.4 58.5,52.4 56.8,52.4 56.8,49.2 53.9,51 63.5,44.4 63.5,40.9 66.5,44.4 69.5,44.4 72.5,44.4 75.5,44.4 66.5,40.9 69.5,40.9 72.5,40.9 75.5,40.9 67,51.9 69,52.9 63,52.5 64.5,55.4 68,56.4 71,56.4 74,56.4 71,53.4 74,53.4 77,53.9 79.5,56.9 76,56.9 79.5,59.9 76.5,59.9 76.5,62.9 79.5,62.9 79.5,65.9 79.5,68.9 80.6,71.2 82.35,72.9 82.45,80.25 81.1,82 79.5,83.9 76.5,65.9 76.5,68.9 77.2,72.1 79.9,78.6 77.6,81.2 76.4,83.9 82.4,83.9 85.5,83.9 60.5,40.9 54.5,40.9 54.5,44.4 63.5,45.4 51.88,48.88 54,46.66 51.88,44.54 49.66,42.52 47.54,40.4 45.32,38.38 43,36.02 40.88,33.9 38.76,31.78 36.64,29.66 34.52,27.54 36.64,25.42 38.76,27.54 40.88,29.66 43,31.78 45.12,33.9 47.24,36.02 49.36,38.14 51.48,40.26 49.76,46.76 47.64,44.74 45.52,42.52 43,40.52 39.6,41.24 38.82,44.34 40.54,46.82 42.66,48.94 44.26,51.68 40.1,36.98 36.6,39.48 35.1,43.48 35.6,46.98 38.1,48.98 40.22,51.1 44.46,53.9 22.06,55.78 19.86,57.66 18.78,60.92 19.7,64.44 22.12,66.84 23.06,59.54 22.24,61.68 23.92,63.7 78.68,43.38 80.74,41.36 81.24,38.86 80.74,35.86 79.24,33.36 76.24,31.86 77.5,38.4 75.5,35.9 62,47.4 62,46.4 31.5,58.4 31.5,55.4 34.5,58.4 34.5,55.4 36,55.4 36,54.4 37.5,58.4 40.5,58.7 43.5,58.7 46.5,58.4 46.5,55.4 49,60.4 51.5,57.9 51.12,62.52 53.24,64.64 55.36,66.76 57.48,68.88 59.6,71 61.72,73.12 63.84,75.24 53.62,60.02 55.74,62.14 57.86,64.26 59.98,66.38 62.1,68.5 64.22,70.62 66.34,72.74 49.12,56.16 15,79.9 25,79.9 35,79.9 45,79.9 55,79.9 40,74.9 30,74.9 20,74.9 15,69.9 10,64.9 15,59.9 45,69.9 40,64.9 60,84.9 65,79.9 70,74.9 85,69.9 90,84.9 90,64.9 85,59.9 65,59.9 60,54.9 85,39.9 90,34.9 85,29.9 90,24.9 85,19.9 90,14.9 85,9.9 80,14.9 75,9.9 70,14.9 75,19.9 80,24.9 70,24.9 75,29.9 65,9.9 60,14.9 65,19.9 60,24.9 55,19.9 45,19.9 40,14.9 35,9.9 30,14.9 25,19.9 30,24.9 35,19.9 55,29.9 60,34.9 25,9.9 20,14.9 15,9.9 10,14.9 10,24.9 10,34.9 15,29.9 15,19.9 20,24.9 25,29.9 20,34.9 15,39.9 20,44.9 25,39.9 30,44.9 65,89.9 25,69.9 83.4,75.5 79.3,74.3 87,51.7 83,51.7 51.8,16.7 51.8,12.7 5.7,79.3 8.8,79.4 11.3,79.3
  pour Top (isolate 0.2, rank 6): 0,-0.1 0,94.6 99.8,94.6 99.8,-0.1
  pour Bottom (isolate 0.2, rank 6): 0,-0.1 0,94.6 99.8,94.6 99.8,-0.1
  pour Route2 (isolate 0.2, rank 6): 0,-0.1 0,94.6 99.8,94.6 99.8,-0.1
  pour Route15 (isolate 0.2, rank 6): 0,-0.1 0,94.6 99.8,94.6 99.8,-0.1
LBAND_0  (via drill 1)
  Bottom 0.38: U$3.P$4 75,42.67 arc-180 v75,33.7
LBAND_90  (via drill 1)
  Bottom 0.38: U$3.P$6 53.02,42.67 arc45 50.9,41.8 v33.8,24.7
LBAND_180  (via drill 1)
  Bottom 0.38: U$2.P$4 24.8,56.92 arc-180 v24.8,65.9
LBAND_270  (via drill 1)
  Bottom 0.38: U$2.P$6 46.78,56.92 arc45 48.9,57.8 v66,74.9
MAG-POWER  (via drill 0.25)
  Top 0.5: CF1.5 10.13,78.05 v5.75,78.05 4.67,78.05 CF1.6
  Bottom 0.5: J6.6 J6.5 37.77,91.17 36.9,92.05 22.2,92.05 21.9,92.05 7.75,92.05 4.65,88.96 4.65,79.15 v5.75,78.05 v6.35,78.05
MAG-SCL  (via drill 0.25)
  Top 0.3: CF1.4 v5.7,76.8 CF1.3
  Bottom 0.3: J6.4 J6.3 39.05,91.23 37.7,92.57 22.2,92.57 7.53,92.57 4.13,89.17 4.13,77.77 5.1,76.8 v5.7,76.8
MAG-SDA  (via drill 0.25)
  Top 0.3: CF1.2 4.67,75.5 v5.7,75.5 10.12,75.5 CF1.1
  Bottom 0.3: J6.2 J6.1 40.31,91.19 38.5,93 7.35,93 3.6,89.25 3.6,76.8 4.9,75.5 v5.7,75.5
N$1  (via drill 0.38)
  Top 0.38: CM2.RF v77.9,83
  Bottom 0.38: v77.9,83 80.46,80.44 arc-90 80.46,73.36 79.46,72.36 arc45 78,68.83 78,58 arc-90 74.9,54.9 68.03,54.9 arc90 65.03,51.9 U$1.P$1
N$2
  Bottom 0.38: U$1.P$4 59.83,48.91 arc90 56.83,45.91 U$3.P$1
N$3
  Bottom 0.38: R1.2 65,48.91 U$1.P$3
N$4
  Bottom 0.38: U$3.P$3 60.2,44.73 R2.2
N$5
  Bottom 0.38: U$1.P$6 57.23,50.89 arc45 55.11,50.01 45.29,40.19 arc-180 38.34,47.14 42.09,50.89 arc45 42.97,53.01 U$2.P$1
N$6
  Bottom 0.38: R3.2 40.99,54.9 U$2.P$3
N$7
  Top 0.3: J1.7 J1.8 50.5,84.25 TP1.1
N$8
  Top 0.3: J2.7 J2.8 17.46,50.43 TP2.1
N$9
  Top 0.3: J3.7 J3.8 49.27,17.5 TP3.1
N$10
  Top 0.3: J4.7 J4.8 82.4,49.16 TP4.1
N$11  (via drill 1)
  other vias: 75,65.9
N$12  (via drill 0.38)
  Top 0.38: CM3.RF v83.9,83.5
  Bottom 0.38: v83.9,83.5 83.9,77.9 arc90 85.9,75.9 U$4.P$1
N$14  (via drill 1)
  other vias: 24.8,33.7
N$17  (via drill 1)
  other vias: 66,24.7
N$26  (via drill 1)
  other vias: 33.8,74.9
OPD_PWR
  Bottom 0.5: J6.15 J6.16
OPD_SCL
  Bottom 0.3: J6.14 J6.13
OPD_SDA
  Bottom 0.3: J6.11 J6.12
SPARE2
  Bottom 0.3: J6.7 J6.8
TURNSTILE-DEPLOY
  pour Route2 (isolate 0.2, no thermals): 33.8,90.5 33.8,50.5 59.4,50.5 59.4,74.4 48.2,74.4 43.5,79.1 43.5,90.5
UHF_0  (via drill 1)
  Bottom 0.813: U$8.P$1 v70.8,70.7
UHF_90  (via drill 1)
  Bottom 0.813: U$7.P$1 v29,70.7
UHF_180  (via drill 1)
  Bottom 0.813: U$6.P$1 v29,28.9
UHF_270  (via drill 1)
  Bottom 0.813: U$5.P$1 v70.8,28.9
VBUS  (via drill 0.25)
  Top 0.5: J1.6 J1.5
  other vias: 49.2,86.4 49.2,86.9 49.2,87.4 13.3,49.2 12.8,49.2 12.3,49.2 86.6,50.4 87.1,50.4 87.6,50.4 50.5,13.2 50.5,12.7 50.5,12.2
  pour Route15 (isolate 0.2): 2,87.9 6,91.9 28.5,91.9 28.5,86.4 48.6,86.4 48.6,87.8 50,87.8 50,83.9 11,83.9 6,78.9 6,50.9 14,50.9 14,47.9 6,47.9 6,12.9 10,8.9 49,8.9 49,13.9 52,13.9 52,8.9 90,8.9 94,12.9 94,44.9 90,48.9 86,48.9 86,51.9 92,51.9 98,45.9 98,10.9 92,4.9 8,4.9 2,10.9
  pour Top (isolate 0.2, no thermals): 50,83.9 50,87.8 48.6,87.8 48.6,83.9
  pour Top (isolate 0.2, no thermals): 15.8,49.9 11.9,49.9 11.9,48.4 15.8,48.4
  pour Top (isolate 0.2, no thermals): 84.1,49.7 88,49.7 88,51.2 84.1,51.2
  pour Top (isolate 0.2, no thermals): 49.8,15.7 49.8,11.8 51.3,11.8 51.3,15.7

### Text on the board
tPlace: OreSat0 +Z End Card | v1.0 2020-08-20